# EAGLE schematic v0.1sch (EAGLE 9.6.2)
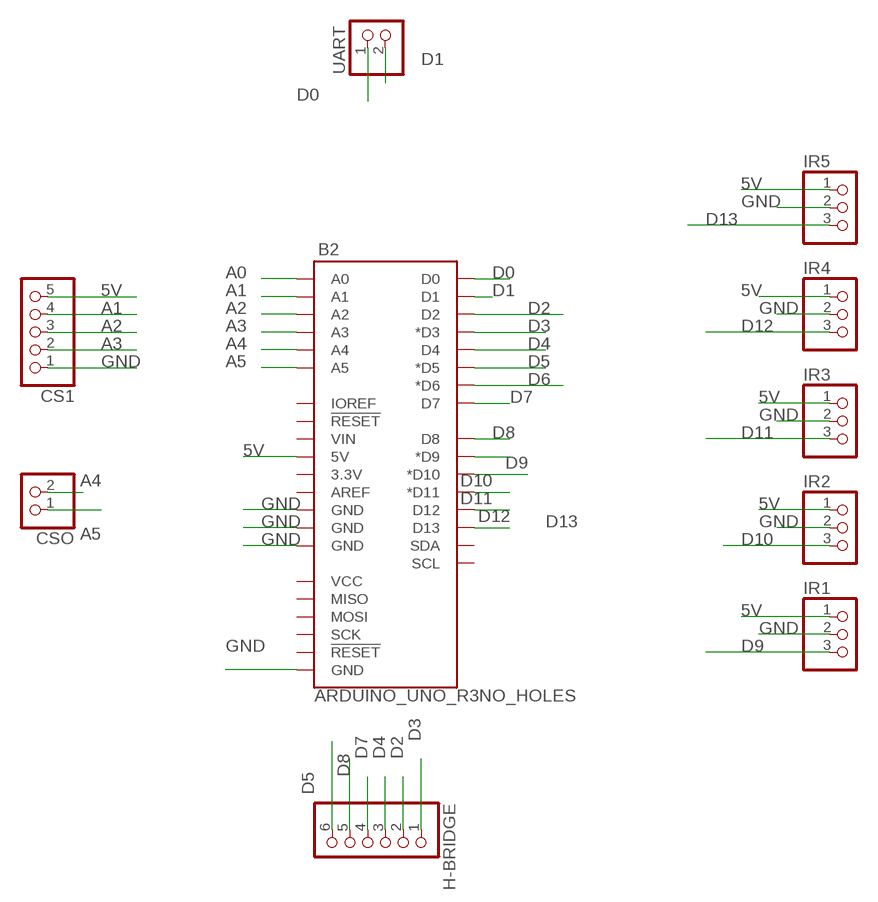
[diagram p0: schematic, sheet 1]

## Parts
B2  ARDUINO_UNO_R3NO_HOLES  [ARDUINO_R3_NO_HOLES]
CS1  PINHD-1X5  [1X05]
CSO  PINHD-1X2  [1X02]
H-BRIDGE  PINHD-1X6  [1X06]
IR1  PINHD-1X3  [1X03]
IR2  PINHD-1X3  [1X03]
IR3  PINHD-1X3  [1X03]
IR4  PINHD-1X3  [1X03]
IR5  PINHD-1X3  [1X03]
UART  PINHD-1X2  [1X02]

## Nets
5V: B2.5V CS1.5 IR1.1 IR2.1 IR3.1 IR4.1 IR5.1
A0: B2.A0
A1: B2.A1 CS1.4
A2: B2.A2 CS1.3
A3: B2.A3 CS1.2
A4: B2.A4 CSO.2
A5: B2.A5 CSO.1
D0: B2.D0 UART.1
D1: B2.D1 UART.2
D2: B2.D2 H-BRIDGE.2
D3: B2.D3(*D3) H-BRIDGE.1
D4: B2.D4 H-BRIDGE.3
D5: B2.D5(*D5) H-BRIDGE.6
D6: B2.D6(*D6)
D7: B2.D7 H-BRIDGE.4
D8: B2.D8 H-BRIDGE.5
D9: B2.D9(*D9) IR1.3
D10: B2.D10(*D10) IR2.3
D11: B2.D11(*D11) IR3.3
D12: B2.D12 IR4.3
D13: B2.D13 IR5.3
GND: B2.GND@1(GND) B2.GND@2(GND) B2.GND@3(GND) B2.GND@4(GND) CS1.1 IR1.2 IR2.2 IR3.2 IR4.2 IR5.2
Unconnected: B2.3.3V B2.AREF B2.IOREF B2.MISO B2.MOSI B2.RESET@1(!RESET!) B2.RESET@2(!RESET!) B2.SCK B2.SCL B2.SDA B2.VCC B2.VIN

## Library data of the parts
B2 = SparkFun-Boards:ARDUINO_UNO_R3: Arduino R3 Footprint with SPI header Arduino Uno R3 Compatible Footprint. Matches PCB size of the original board. SparkFun Products: SAMD21 Dev Breakout <https://www.sparkfun.com/products/13672> RedBoard <https://www.sparkfun.com/products/12757> R3 Stackable Headers <https://www.sparkfun.com/products/11417>
CS1 = pinhead:PINHD-1X5: PIN HEADER
CSO UART = pinhead:PINHD-1X2: PIN HEADER
H-BRIDGE = pinhead:PINHD-1X6: PIN HEADER
IR1-IR5 = pinhead:PINHD-1X3: PIN HEADER